# Altium schematic sheet _RAlimentation.SchDoc
size Letter; Organization: Cegep Limoilou; Address1: 1300, 8e Avenue; Address2: Québec, QC; Address3: Canada; Address4: G1J 5L5; Revision: Enseignants; SheetNumber: 6; SheetTotal: 11; Conception: Ilyes Gharmoul; Titre: Alimentation; Modification: Ilyes G
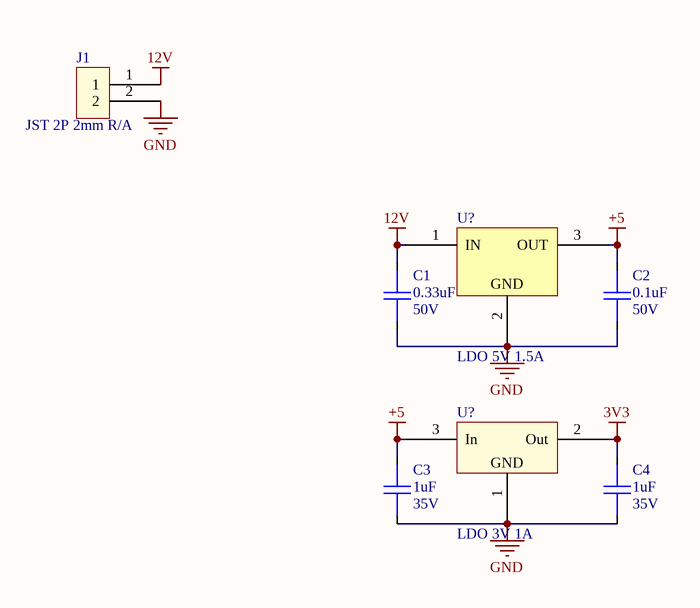
[diagram p0: _RAlimentation.SchDoc]

## Parts
(Parts that share a designator on the sheet are numbered #1, #2 ... from top to bottom, then left to right.)
C1  value 0.33uF  Volt: 50V  [0603 X7R]  (hidden comment: 330nF 50V)
C2  value 0.1uF  Volt: 50V  [0603 X7R]  (hidden comment: 0.1uF 50V)
C3  value 1uF  Volt: 35V  [0603 X7R]  (hidden comment: 1uF 35V)
C4  value 1uF  Volt: 35V  [0603 X7R]  (hidden comment: 1uF 35V)
J1  JST 2P 2mm R/A  [JST 2P 2mm R_A-Footprint-1]
U?#1  LDO 5V 1.5A  [LDO 5V 1.5A]
U?#2  LDO 3V 1A  [SOT-223]

## Nets
3V3: C4.2 U?#2.2(Out)
12V: C1.2 J1.1 U?#1.1(IN)
+5: C2.2 C3.2 U?#1.3(OUT) U?#2.3(In)
GND: C1.1 C2.1 C3.1 C4.1 J1.2 U?#1.2(GND) U?#2.1(GND)

## Notes on the sheet
- Titre :
- Conception :
- Date :
- Modification :
- Heure :
- Révision :
- Feuille
- de
- Fichier :

## Library data of the parts
C1 = CMP-048-000021-3: CAP CER 0.33UF 50V X5R 0603; Manufacturer Part Number: CGA3E3X5R1H334K080AB; Manufacturer: TDK; Tri: 330000; Verifier: Maxim Ayotte; Source: IC_Cap.SchLib; Design Item ID: 330nF 50V
C2 = CMP-048-000010-6: CAP CER 0.1UF 50V X7R 0603; Manufacturer Part Number 1: 06035C104K4T2A; Source: IC_Cap.SchLib; Design Item ID: 0.1uF 50V
C3 C4 = CMP-048-000033-3: 1µF ±10% 35V Ceramic Capacitor X7R 0603 (1608 Metric); Manufacturer Part Number: GMJ107CB7105MAHR; Manufacturer: Taiyo Yuden; Verifier: Maxim Ayotte; Tri: 1000000; Design Item ID: 1uF 35V X7R; Source: IC_Cap.SchLib
J1 = CMP-00129-1: Connector Header Through Hole, Right Angle 2 position 0.079" (2.00mm); Manufacturer Part Number 1: S2B-PH-K-S(LF)(SN)
U?#1 = CMP-035-000005-3: IC REG LINEAR 5V 1.5A DPAK; Manufacturer Part Number: L7805CDT-TR; Manufacturer: STMicroelectronics; Source: IC_Component.SchLib; Design Item ID: LDO 5V 1.5A; Supplier: Digi-Key; Component Type: Power Supply
U?#2 = CMP-00131-2: IC REG LINEAR 3V 1A SOT223-4; Manufacturer Part Number 1: TLV1117LV30DCYR; Manufacturer: Texas Instruments; Manufacturer Part Number: TLV1117LV30DCYR; Component Type: Power Supply